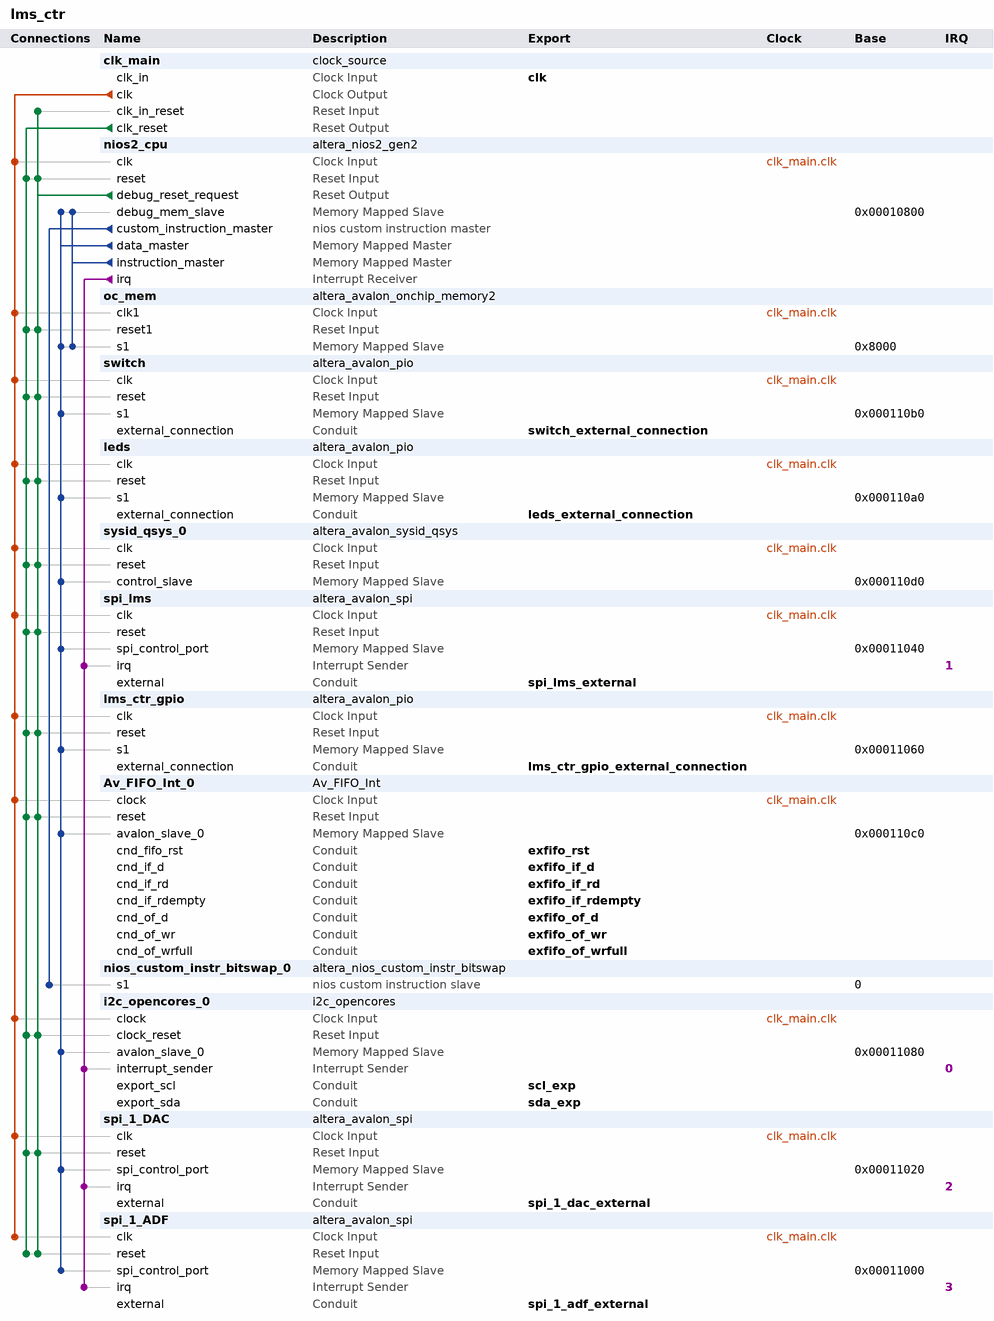
[diagram p0: system contents]
# Platform Designer (Qsys) system lms_ctr, Cyclone IV E EP4CE40F23C8
# Parameters at their usual value, and those the tool derives, are not listed.
package require -exact qsys 15.1
create_system lms_ctr
set_project_property DEVICE_FAMILY {Cyclone IV E}
set_project_property DEVICE EP4CE40F23C8

add_instance clk_main clock_source 15.1
set_instance_parameter_value clk_main clockFrequency 100000000

add_instance nios2_cpu altera_nios2_gen2 15.1
set_instance_parameter_value nios2_cpu dcache_size 2048
set_instance_parameter_value nios2_cpu exceptionSlave oc_mem.s1
set_instance_parameter_value nios2_cpu icache_size 4096
set_instance_parameter_value nios2_cpu impl Tiny
set_instance_parameter_value nios2_cpu resetSlave oc_mem.s1

add_instance oc_mem altera_avalon_onchip_memory2 15.1
set_instance_parameter_value oc_mem dataWidth 32
set_instance_parameter_value oc_mem dualPort false
set_instance_parameter_value oc_mem initMemContent true
set_instance_parameter_value oc_mem initializationFileName onchip_mem.hex
set_instance_parameter_value oc_mem memorySize 32768

add_instance switch altera_avalon_pio 15.1
set_instance_parameter_value switch direction Input
set_instance_parameter_value switch width 8

add_instance leds altera_avalon_pio 15.1
set_instance_parameter_value leds direction Output
set_instance_parameter_value leds width 8

add_instance sysid_qsys_0 altera_avalon_sysid_qsys 15.1
set_instance_parameter_value sysid_qsys_0 id 4920

add_instance spi_lms altera_avalon_spi 15.1
set_instance_parameter_value spi_lms clockPolarity 0
set_instance_parameter_value spi_lms dataWidth 8
set_instance_parameter_value spi_lms insertDelayBetweenSlaveSelectAndSClk true
set_instance_parameter_value spi_lms masterSPI true
set_instance_parameter_value spi_lms numberOfSlaves 5
set_instance_parameter_value spi_lms targetClockRate 20000000
set_instance_parameter_value spi_lms targetSlaveSelectToSClkDelay 200.0

add_instance lms_ctr_gpio altera_avalon_pio 15.1
set_instance_parameter_value lms_ctr_gpio bitModifyingOutReg true
set_instance_parameter_value lms_ctr_gpio direction Output
set_instance_parameter_value lms_ctr_gpio resetValue 3
set_instance_parameter_value lms_ctr_gpio width 4

add_instance Av_FIFO_Int_0 Av_FIFO_Int 1.0
set_instance_parameter_value Av_FIFO_Int_0 width 32

add_instance nios_custom_instr_bitswap_0 altera_nios_custom_instr_bitswap 15.1

add_instance i2c_opencores_0 i2c_opencores 13.0

add_instance spi_1_DAC altera_avalon_spi 15.1
set_instance_parameter_value spi_1_DAC clockPhase 1
set_instance_parameter_value spi_1_DAC clockPolarity 0
set_instance_parameter_value spi_1_DAC dataWidth 8
set_instance_parameter_value spi_1_DAC insertDelayBetweenSlaveSelectAndSClk true
set_instance_parameter_value spi_1_DAC masterSPI true
set_instance_parameter_value spi_1_DAC numberOfSlaves 1
set_instance_parameter_value spi_1_DAC targetClockRate 20000000
set_instance_parameter_value spi_1_DAC targetSlaveSelectToSClkDelay 200.0

add_instance spi_1_ADF altera_avalon_spi 15.1
set_instance_parameter_value spi_1_ADF clockPolarity 0
set_instance_parameter_value spi_1_ADF dataWidth 8
set_instance_parameter_value spi_1_ADF insertDelayBetweenSlaveSelectAndSClk true
set_instance_parameter_value spi_1_ADF masterSPI true
set_instance_parameter_value spi_1_ADF numberOfSlaves 1
set_instance_parameter_value spi_1_ADF targetClockRate 20000000
set_instance_parameter_value spi_1_ADF targetSlaveSelectToSClkDelay 200.0

# connections
add_connection clk_main.clk Av_FIFO_Int_0.clock clock
add_connection clk_main.clk i2c_opencores_0.clock clock
add_connection clk_main.clk leds.clk clock
add_connection clk_main.clk lms_ctr_gpio.clk clock
add_connection clk_main.clk nios2_cpu.clk clock
add_connection clk_main.clk oc_mem.clk1 clock
add_connection clk_main.clk spi_1_ADF.clk clock
add_connection clk_main.clk spi_1_DAC.clk clock
add_connection clk_main.clk spi_lms.clk clock
add_connection clk_main.clk switch.clk clock
add_connection clk_main.clk sysid_qsys_0.clk clock
add_connection clk_main.clk_reset Av_FIFO_Int_0.reset reset
add_connection clk_main.clk_reset i2c_opencores_0.clock_reset reset
add_connection clk_main.clk_reset leds.reset reset
add_connection clk_main.clk_reset lms_ctr_gpio.reset reset
add_connection clk_main.clk_reset nios2_cpu.reset reset
add_connection clk_main.clk_reset oc_mem.reset1 reset
add_connection clk_main.clk_reset spi_1_ADF.reset reset
add_connection clk_main.clk_reset spi_1_DAC.reset reset
add_connection clk_main.clk_reset spi_lms.reset reset
add_connection clk_main.clk_reset switch.reset reset
add_connection clk_main.clk_reset sysid_qsys_0.reset reset
add_connection nios2_cpu.debug_reset_request Av_FIFO_Int_0.reset reset
add_connection nios2_cpu.debug_reset_request clk_main.clk_in_reset reset
add_connection nios2_cpu.debug_reset_request i2c_opencores_0.clock_reset reset
add_connection nios2_cpu.debug_reset_request leds.reset reset
add_connection nios2_cpu.debug_reset_request lms_ctr_gpio.reset reset
add_connection nios2_cpu.debug_reset_request nios2_cpu.reset reset
add_connection nios2_cpu.debug_reset_request oc_mem.reset1 reset
add_connection nios2_cpu.debug_reset_request spi_1_ADF.reset reset
add_connection nios2_cpu.debug_reset_request spi_1_DAC.reset reset
add_connection nios2_cpu.debug_reset_request spi_lms.reset reset
add_connection nios2_cpu.debug_reset_request switch.reset reset
add_connection nios2_cpu.debug_reset_request sysid_qsys_0.reset reset
add_connection nios2_cpu.data_master Av_FIFO_Int_0.avalon_slave_0 avalon
set_connection_parameter_value nios2_cpu.data_master/Av_FIFO_Int_0.avalon_slave_0 baseAddress 0x000110c0
add_connection nios2_cpu.data_master i2c_opencores_0.avalon_slave_0 avalon
set_connection_parameter_value nios2_cpu.data_master/i2c_opencores_0.avalon_slave_0 baseAddress 0x00011080
add_connection nios2_cpu.data_master leds.s1 avalon
set_connection_parameter_value nios2_cpu.data_master/leds.s1 baseAddress 0x000110a0
add_connection nios2_cpu.data_master lms_ctr_gpio.s1 avalon
set_connection_parameter_value nios2_cpu.data_master/lms_ctr_gpio.s1 baseAddress 0x00011060
add_connection nios2_cpu.data_master nios2_cpu.debug_mem_slave avalon
set_connection_parameter_value nios2_cpu.data_master/nios2_cpu.debug_mem_slave baseAddress 0x00010800
add_connection nios2_cpu.data_master oc_mem.s1 avalon
set_connection_parameter_value nios2_cpu.data_master/oc_mem.s1 baseAddress 0x8000
add_connection nios2_cpu.data_master spi_1_ADF.spi_control_port avalon
set_connection_parameter_value nios2_cpu.data_master/spi_1_ADF.spi_control_port baseAddress 0x00011000
add_connection nios2_cpu.data_master spi_1_DAC.spi_control_port avalon
set_connection_parameter_value nios2_cpu.data_master/spi_1_DAC.spi_control_port baseAddress 0x00011020
add_connection nios2_cpu.data_master spi_lms.spi_control_port avalon
set_connection_parameter_value nios2_cpu.data_master/spi_lms.spi_control_port baseAddress 0x00011040
add_connection nios2_cpu.data_master switch.s1 avalon
set_connection_parameter_value nios2_cpu.data_master/switch.s1 baseAddress 0x000110b0
add_connection nios2_cpu.data_master sysid_qsys_0.control_slave avalon
set_connection_parameter_value nios2_cpu.data_master/sysid_qsys_0.control_slave baseAddress 0x000110d0
add_connection nios2_cpu.instruction_master nios2_cpu.debug_mem_slave avalon
set_connection_parameter_value nios2_cpu.instruction_master/nios2_cpu.debug_mem_slave baseAddress 0x00010800
add_connection nios2_cpu.instruction_master oc_mem.s1 avalon
set_connection_parameter_value nios2_cpu.instruction_master/oc_mem.s1 baseAddress 0x8000
add_connection nios2_cpu.irq i2c_opencores_0.interrupt_sender interrupt
set_connection_parameter_value nios2_cpu.irq/i2c_opencores_0.interrupt_sender irqNumber 0
add_connection nios2_cpu.irq spi_1_ADF.irq interrupt
set_connection_parameter_value nios2_cpu.irq/spi_1_ADF.irq irqNumber 3
add_connection nios2_cpu.irq spi_1_DAC.irq interrupt
set_connection_parameter_value nios2_cpu.irq/spi_1_DAC.irq irqNumber 2
add_connection nios2_cpu.irq spi_lms.irq interrupt
set_connection_parameter_value nios2_cpu.irq/spi_lms.irq irqNumber 1
add_connection nios2_cpu.custom_instruction_master nios_custom_instr_bitswap_0.s1 nios_custom_instruction
set_connection_parameter_value nios2_cpu.custom_instruction_master/nios_custom_instr_bitswap_0.s1 CIName nios_custom_instr_bitswap_0
set_connection_parameter_value nios2_cpu.custom_instruction_master/nios_custom_instr_bitswap_0.s1 baseAddress 0

# exported interfaces
add_interface clk clock sink
set_interface_property clk EXPORT_OF clk_main.clk_in
add_interface exfifo_if_d conduit end
set_interface_property exfifo_if_d EXPORT_OF Av_FIFO_Int_0.cnd_if_d
add_interface exfifo_if_rd conduit end
set_interface_property exfifo_if_rd EXPORT_OF Av_FIFO_Int_0.cnd_if_rd
add_interface exfifo_if_rdempty conduit end
set_interface_property exfifo_if_rdempty EXPORT_OF Av_FIFO_Int_0.cnd_if_rdempty
add_interface exfifo_of_d conduit end
set_interface_property exfifo_of_d EXPORT_OF Av_FIFO_Int_0.cnd_of_d
add_interface exfifo_of_wr conduit end
set_interface_property exfifo_of_wr EXPORT_OF Av_FIFO_Int_0.cnd_of_wr
add_interface exfifo_of_wrfull conduit end
set_interface_property exfifo_of_wrfull EXPORT_OF Av_FIFO_Int_0.cnd_of_wrfull
add_interface exfifo_rst conduit end
set_interface_property exfifo_rst EXPORT_OF Av_FIFO_Int_0.cnd_fifo_rst
add_interface leds_external_connection conduit end
set_interface_property leds_external_connection EXPORT_OF leds.external_connection
add_interface lms_ctr_gpio_external_connection conduit end
set_interface_property lms_ctr_gpio_external_connection EXPORT_OF lms_ctr_gpio.external_connection
add_interface scl_exp conduit end
set_interface_property scl_exp EXPORT_OF i2c_opencores_0.export_scl
add_interface sda_exp conduit end
set_interface_property sda_exp EXPORT_OF i2c_opencores_0.export_sda
add_interface spi_1_adf_external conduit end
set_interface_property spi_1_adf_external EXPORT_OF spi_1_ADF.external
add_interface spi_1_dac_external conduit end
set_interface_property spi_1_dac_external EXPORT_OF spi_1_DAC.external
add_interface spi_lms_external conduit end
set_interface_property spi_lms_external EXPORT_OF spi_lms.external
add_interface switch_external_connection conduit end
set_interface_property switch_external_connection EXPORT_OF switch.external_connection

set_interconnect_requirement {$system} qsys_mm.clockCrossingAdapter HANDSHAKE
set_interconnect_requirement {$system} qsys_mm.enableEccProtection FALSE
set_interconnect_requirement {$system} qsys_mm.insertDefaultSlave FALSE
set_interconnect_requirement {$system} qsys_mm.maxAdditionalLatency 1

save_system lms_ctr.qsys
